# Altium project ESP32_SOAD.PrjPcb
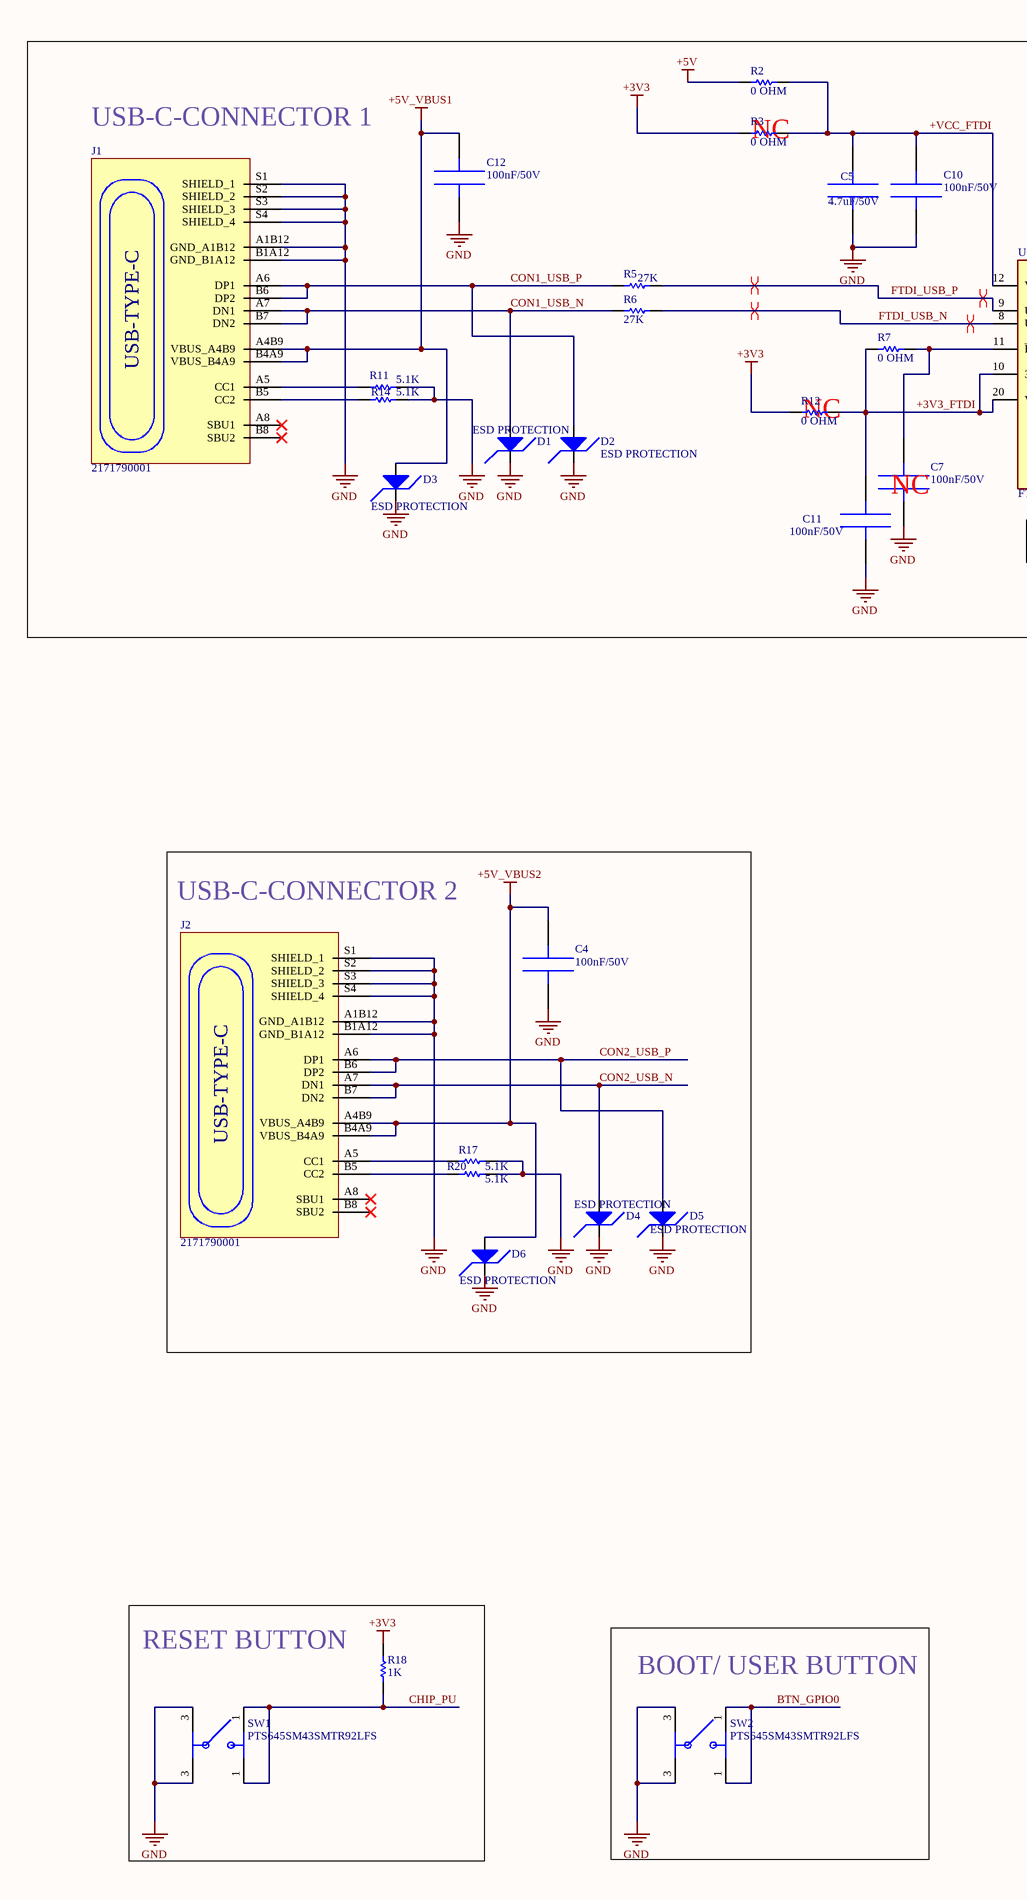
[diagram p0: ESP32-SCH.SchDoc, left]
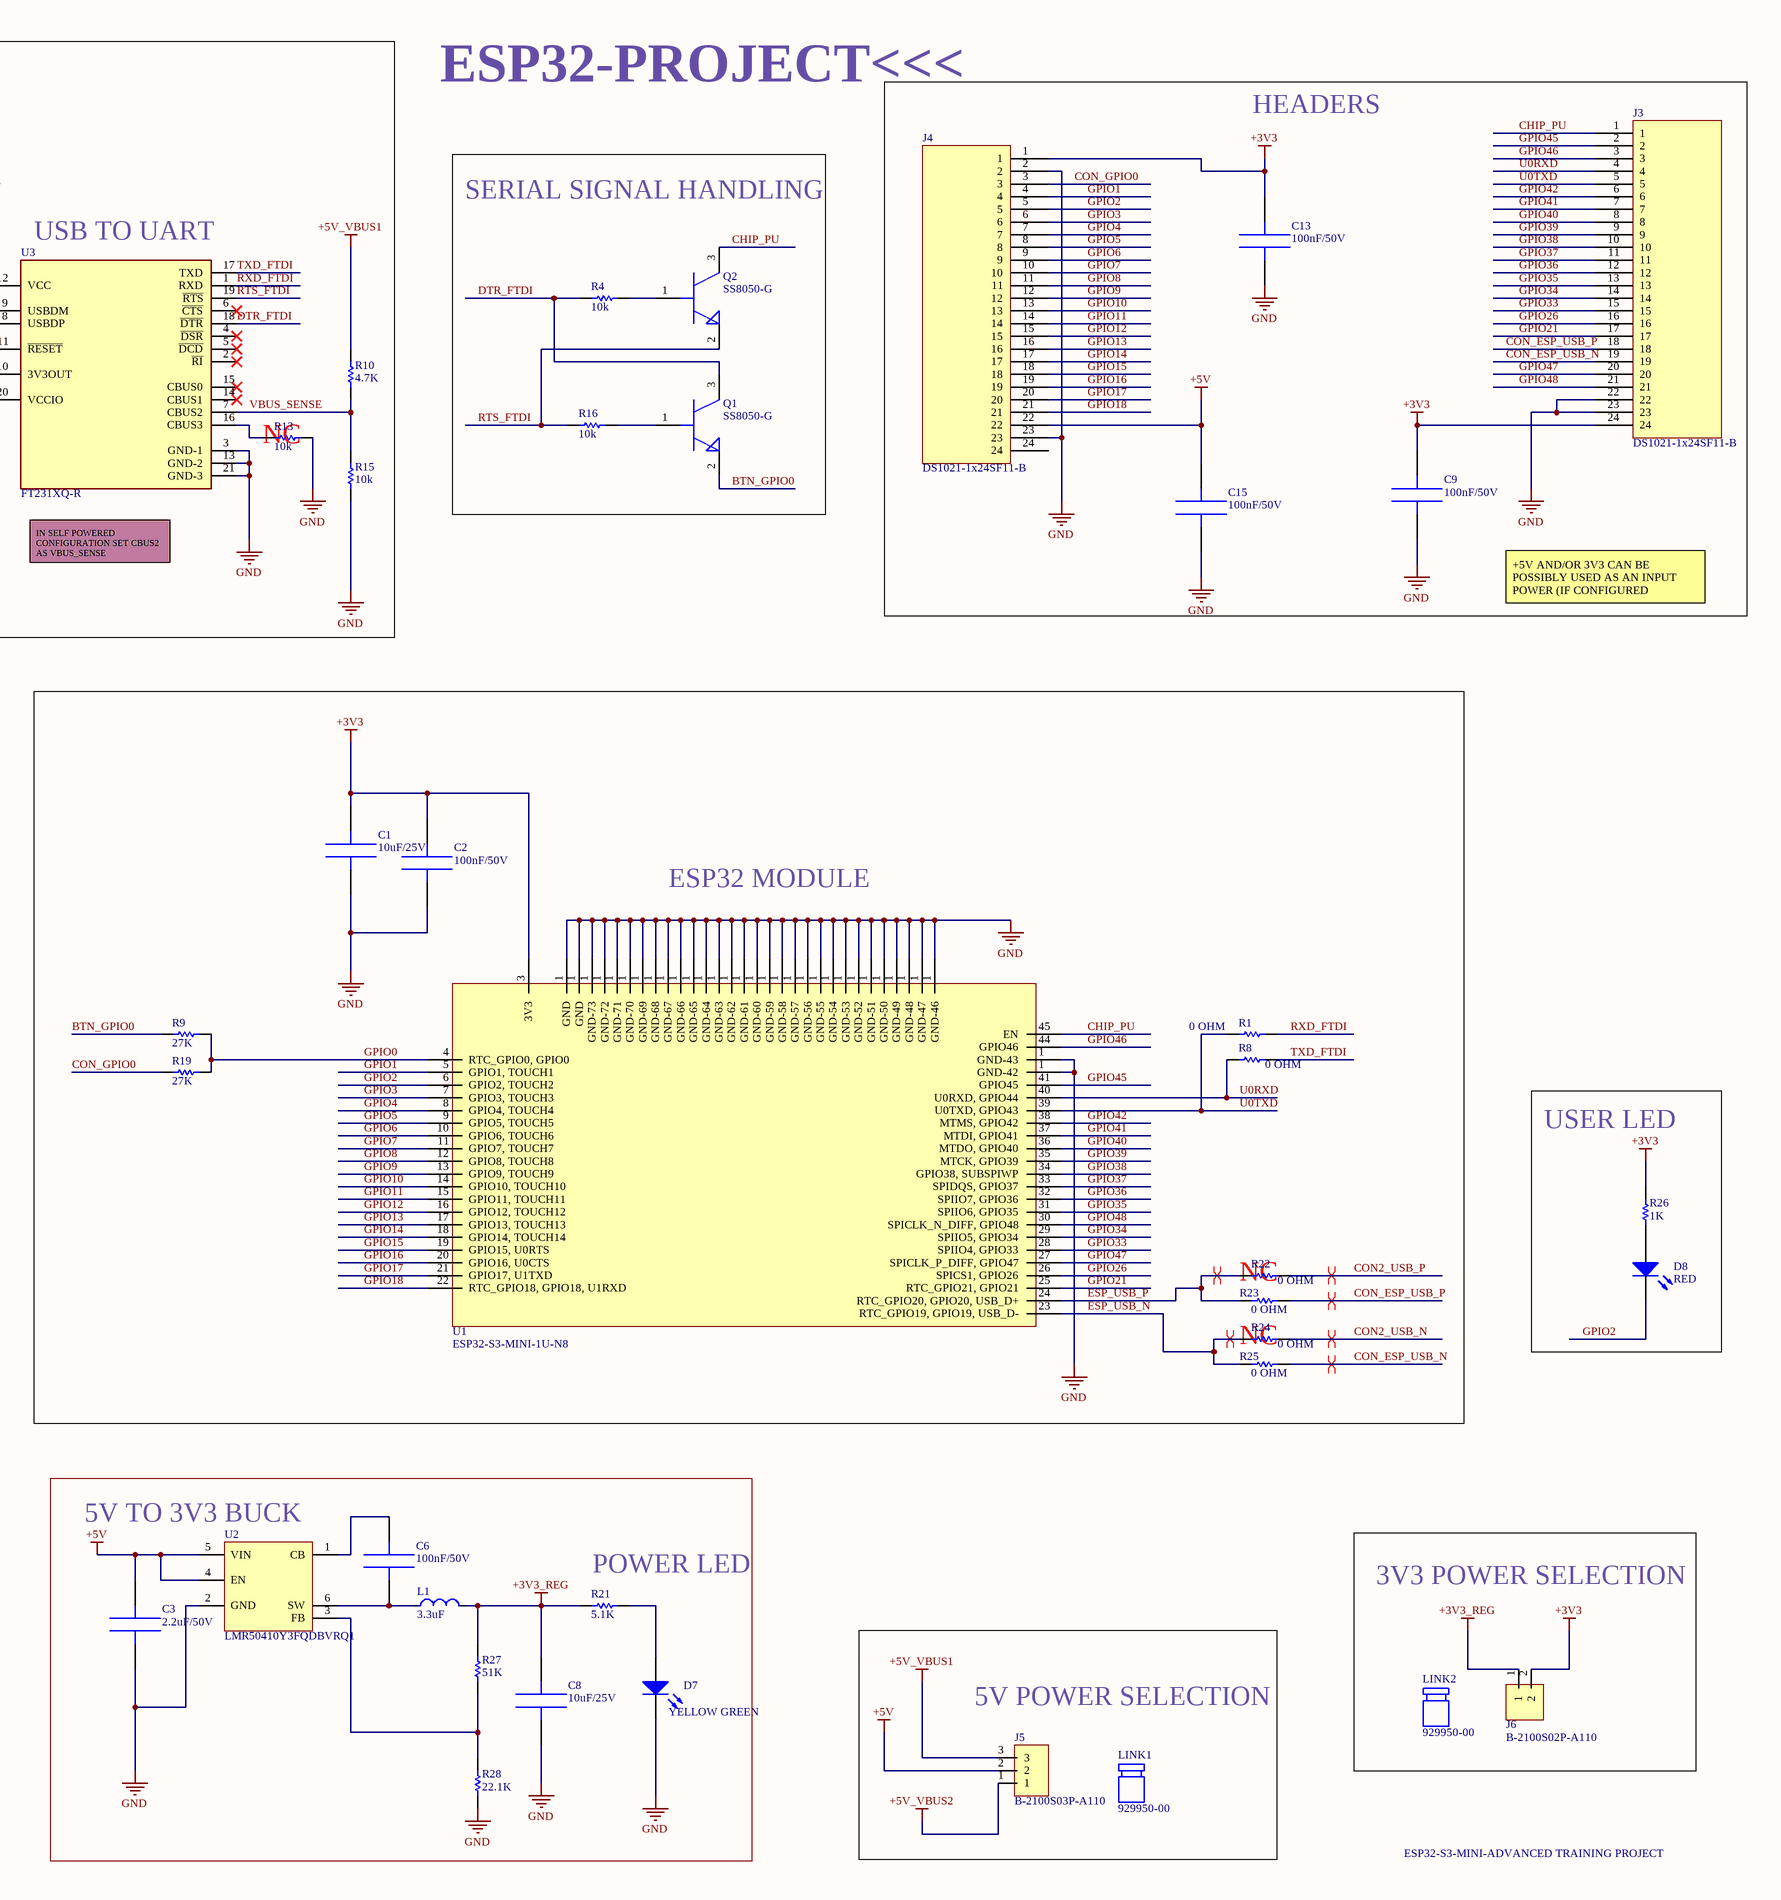
[diagram p1: ESP32-SCH.SchDoc, right]
1 sheet, 66 parts. Net scope: global (net labels, ports and power ports of the same name join across sheets).
Board file: ESP32-PCB.PcbDoc

## Sheet ESP32-SCH.SchDoc
size A2; SheetNumber: 1; SheetTotal: 1

### Parts
C1  10uF/25V  [CL05A106MP8NUB8]
C2  100nF/50V  [CL05A106MP8NUB8]
C3  2.2uF/50V  [CL05A106MP8NUB8]
C4  100nF/50V  [CL05A106MP8NUB8]
C5  4.7uF/50V  [CC0603KRX7R9BB104]
C6  100nF/50V  [CL05A106MP8NUB8]
C7  100nF/50V  [CL05A106MP8NUB8]
C8  10uF/25V  [CL05A106MP8NUB8]
C9  100nF/50V  [CL05A106MP8NUB8]
C10  100nF/50V  [CL05A106MP8NUB8]
C11  100nF/50V  [CL05A106MP8NUB8]
C12  100nF/50V  [CL05A106MP8NUB8]
C13  100nF/50V  [CL05A106MP8NUB8]
C15  100nF/50V  [CL05A106MP8NUB8]
D1  ESD PROTECTION  [ESD5Z3.3T1G]
D2  ESD PROTECTION  [ESD5Z3.3T1G]
D3  ESD PROTECTION  [ESD5Z3.3T1G]
D4  ESD PROTECTION  [ESD5Z3.3T1G]
D5  ESD PROTECTION  [ESD5Z3.3T1G]
D6  ESD PROTECTION  [ESD5Z3.3T1G]
D7  YELLOW GREEN  [VLMG1500-GS08]
D8  RED  [VLMG1500-GS08]
J1  2171790001  [217179-0001]
J2  2171790001  [217179-0001]
J3  DS1021-1x24SF11-B  [DS1021-1x24SF11]
J4  DS1021-1x24SF11-B  [DS1021-1x24SF11]
J5  B-2100S03P-A110  [B-2100S03P-A110]
J6  B-2100S02P-A110  [B-2100S02P-A110]
L1  3.3uF  [MLZ2012N3R3LT000]
LINK1  929950-00  (mechanical)
LINK2  929950-00  (mechanical)
Q1  SS8050-G  [SS8050-G]
Q2  SS8050-G  [SS8050-G]
R1  0 OHM  [RC0402JR]
R2  0 OHM  [RC0402JR]
R3  0 OHM  [RC0402JR]
R4  10k  [RC0402JR]
R5  27K  [RC0402JR]
R6  27K  [RC0402JR]
R7  0 OHM  [RC0402JR]
R8  0 OHM  [RC0402JR]
R9  27K  [RC0402JR]
R10  4.7K  [RC0402JR]
R11  5.1K  [AC0402FR-075K1L]
R12  0 OHM  [RC0402JR]
R13  10k  [RC0402JR]
R14  5.1K  [AC0402FR-075K1L]
R15  10k  [RC0402JR]
R16  10k  [RC0402JR]
R17  5.1K  [AC0402FR-075K1L]
R18  1K  [0603WAF1001T5E]
R19  27K  [RC0402JR]
R20  5.1K  [AC0402FR-075K1L]
R21  5.1K  [AC0402FR-075K1L]
R22  0 OHM  [RC0402JR]
R23  0 OHM  [RC0402JR]
R24  0 OHM  [RC0402JR]
R25  0 OHM  [RC0402JR]
R26  1K  [0603WAF1001T5E]
R27  51K  [RC0402JR]
R28  22.1K  [RC0402JR]
SW1  PTS645SM43SMTR92LFS  [PTS645SM43SMTR92LFS]
SW2  PTS645SM43SMTR92LFS  [PTS645SM43SMTR92LFS]
U1  ESP32-S3-MINI-1U-N8  [ESP32-S3-MINI-1U-N8_1]
U2  LMR50410Y3FQDBVRQ1  [LMR50410Y3FQDBVRQ1]
U3  FT231XQ-R  [FT231XQ-R]

### Blocks framed on the sheet
HEADERS: C9 C13 C15 J3 J4
SERIAL SIGNAL HANDLING: Q1 Q2 R4 R16
USB-C-CONNECTOR 2: C4 D4-D6 J2 R17 R20
USER LED: D8 R26
3V3 POWER SELECTION: J6
RESET BUTTON: R18 SW1
BOOT/ USER BUTTON: SW2
5V POWER SELECTION: J5

### Nets
+3V3: C1.2 C2.2 C9.2 C13.2 J3.24 J4.1 J6.2 R3.1 R12.1 R18.2 R26.2 U1.3(3V3)
+3V3_REG: C8.2 J6.1 L1.2 R21.1 R27.2
+5V: C3.1 C15.2 J4.22 J5.2 R2.1 U2.4(EN) U2.5(VIN)
+5V_VBUS1: C12.2 D3.2 J1.A4B9(VBUS_A4B9) J1.B4A9(VBUS_B4A9) J5.3 R10.2
+5V_VBUS2: C4.2 D6.2 J2.A4B9(VBUS_A4B9) J2.B4A9(VBUS_B4A9) J5.1
GND: C1.1 C2.1 C3.2 C4.1 C5.1 C7.1 C8.1 C9.1 C10.1 C11.1 C12.1 C13.1 C15.1 D1.1 D2.1 D3.1 D4.1 D5.1 D6.1 D7.2 J1.A1B12(GND_A1B12) J1.B1A12(GND_B1A12) J1.S1(SHIELD_1) J1.S2(SHIELD_2) J1.S3(SHIELD_3) J1.S4(SHIELD_4) J2.A1B12(GND_A1B12) J2.B1A12(GND_B1A12) J2.S1(SHIELD_1) J2.S2(SHIELD_2) J2.S3(SHIELD_3) J2.S4(SHIELD_4) J3.22 J3.23 J4.2 J4.23 R11.2 R13.2 R14.2 R15.1 R17.2 R20.2 R28.1 SW1.3 SW2.3 U1.1(GND-46) U2.2(GND) U3.3(GND-1) U3.13(GND-2) U3.21(GND-3)
+3V3_FTDI: C11.2 R7.1 R12.2 U3.10(3V3OUT) U3.20(VCCIO)
+VCC_FTDI: C5.2 C10.2 R2.2 R3.2 U3.12(VCC)
BTN_GPIO0: Q1.2(E) R9.1 SW2.1
CHIP_PU: J3.1 Q2.3(C) R18.1 SW1.1 U1.45(EN)
CON1_USB_N: D1.2 J1.A7(DN1) J1.B7(DN2) R6.1
CON1_USB_P: D2.2 J1.A6(DP1) J1.B6(DP2) R5.1
CON2_USB_N: D4.2 J2.A7(DN1) J2.B7(DN2) R24.2
CON2_USB_P: D5.2 J2.A6(DP1) J2.B6(DP2) R22.2
CON_ESP_USB_N: J3.19 R25.2
CON_ESP_USB_P: J3.18 R23.2
CON_GPIO0: J4.3 R19.1
DTR_FTDI: Q1.3(C) R4.1 U3.18(~{DTR})
ESP_USB_N: R24.1 R25.1 U1.23(RTC_GPIO19,_GPIO19,_USB_D-)
ESP_USB_P: R22.1 R23.1 U1.24(RTC_GPIO20,_GPIO20,_USB_D+)
FTDI_USB_N: R6.2 U3.8(USBDP)
FTDI_USB_P: R5.2 U3.9(USBDM)
GPIO0: R9.2 R19.2 U1.4(RTC_GPIO0,_GPIO0)
GPIO1: J4.4 U1.5(GPIO1,_TOUCH1)
GPIO2: D8.2 J4.5 U1.6(GPIO2,_TOUCH2)
GPIO3: J4.6 U1.7(GPIO3,_TOUCH3)
GPIO4: J4.7 U1.8(GPIO4,_TOUCH4)
GPIO5: J4.8 U1.9(GPIO5,_TOUCH5)
GPIO6: J4.9 U1.10(GPIO6,_TOUCH6)
GPIO7: J4.10 U1.11(GPIO7,_TOUCH7)
GPIO8: J4.11 U1.12(GPIO8,_TOUCH8)
GPIO9: J4.12 U1.13(GPIO9,_TOUCH9)
GPIO10: J4.13 U1.14(GPIO10,_TOUCH10)
GPIO11: J4.14 U1.15(GPIO11,_TOUCH11)
GPIO12: J4.15 U1.16(GPIO12,_TOUCH12)
GPIO13: J4.16 U1.17(GPIO13,_TOUCH13)
GPIO14: J4.17 U1.18(GPIO14,_TOUCH14)
GPIO15: J4.18 U1.19(GPIO15,_U0RTS)
GPIO16: J4.19 U1.20(GPIO16,_U0CTS)
GPIO17: J4.20 U1.21(GPIO17,_U1TXD)
GPIO18: J4.21 U1.22(RTC_GPIO18,_GPIO18,_U1RXD)
GPIO21: J3.17 U1.25(RTC_GPIO21,_GPIO21)
GPIO26: J3.16 U1.26(SPICS1,_GPIO26)
GPIO33: J3.15 U1.28(SPIIO4,_GPIO33)
GPIO34: J3.14 U1.29(SPIIO5,_GPIO34)
GPIO35: J3.13 U1.31(SPIIO6,_GPIO35)
GPIO36: J3.12 U1.32(SPIIO7,_GPIO36)
GPIO37: J3.11 U1.33(SPIDQS,_GPIO37)
GPIO38: J3.10 U1.34(GPIO38,_SUBSPIWP)
GPIO39: J3.9 U1.35(MTCK,_GPIO39)
GPIO40: J3.8 U1.36(MTDO,_GPIO40)
GPIO41: J3.7 U1.37(MTDI,_GPIO41)
GPIO42: J3.6 U1.38(MTMS,_GPIO42)
GPIO45: J3.2 U1.41(GPIO45)
GPIO46: J3.3 U1.44(GPIO46)
GPIO47: J3.20 U1.27(SPICLK_P_DIFF,_GPIO47)
GPIO48: J3.21 U1.30(SPICLK_N_DIFF,_GPIO48)
RTS_FTDI: Q2.2(E) R16.1 U3.19(~{RTS})
RXD_FTDI: R1.2 U3.1(RXD)
TXD_FTDI: R8.2 U3.17(TXD)
U0RXD: J3.4 R8.1 U1.40(U0RXD,_GPIO44)
U0TXD: J3.5 R1.1 U1.39(U0TXD,_GPIO43)
VBUS_SENSE: R10.1 R15.2 U3.7(CBUS2)
NetC6_1: C6.1 L1.1 U2.6(SW)
NetC6_2: C6.2 U2.1(CB)
NetC7_2: C7.2 R7.2 U3.11(~{RESET})
NetD7_1: D7.1 R21.2
NetD8_1: D8.1 R26.1
NetJ1_A5: J1.A5(CC1) R11.1
NetJ1_B5: J1.B5(CC2) R14.1
NetJ2_A5: J2.A5(CC1) R17.1
NetJ2_B5: J2.B5(CC2) R20.1
NetQ1_1: Q1.1(B) R16.2
NetQ2_1: Q2.1(B) R4.2
NetR13_1: R13.1 U3.16(CBUS3)
NetR27_1: R27.1 R28.2 U2.3(FB)

Not connected (* = marked no-connect by the designer): J1 A8(SBU1)* B8(SBU2)*; J2 A8(SBU1)* B8(SBU2)*; J4 24; U3 2(~{RI})* 4(~{DSR})* 5(~{DCD})* 6(~{CTS})* 14(CBUS1)* 15(CBUS0)*

### Layout directives
differential pair; differential pair class DIFF90: CON2_USB_N, CON2_USB_P, CON_ESP_USB_N, CON_ESP_USB_P, ESP_USB_N, ESP_USB_P, FTDI_USB_N, FTDI_USB_P

### Notes on the sheet
- ESP32-PROJECT<<<
- USB-C-CONNECTOR 1
- (near R3) NC
- (near U3) USB TO UART
- (near R12) NC
- (near R13) NC
- (near C7) NC
- (near U3) IN SELF POWERED CONFIGURATION SET CBUS2 AS VBUS_SENSE
- +5V AND/OR 3V3 CAN BE POSSIBLY USED AS AN INPUT POWER (IF CONFIGURED CORRECTLY)
- ESP32 MODULE
- (near R22) NC
- (near R24) NC
- (near U2) 5V TO 3V3 BUCK
- (near R21) POWER LED
- ESP32-S3-MINI-ADVANCED TRAINING PROJECT
- (in symbol 217179-0001) USB-TYPE-C

### Library data of the parts
C1 C8 = CL05A106MP8NUB8: Ceramic Capacitor, Multilayer, Ceramic, 10V, 20% +Tol, 20% -Tol, X5R, 15% TC, 10uF, Surface Mount, 0402; Manufacturer: Samsung; Multilayer: Yes; Supplier: Mouser; Supplier Part Number: 187-CL05A106MP8NUB8; Manufacturer Part Number: CL05A106MP8NUB8; RoHS: Yes; Category: Ceramic Capacitors; Stock: 496808; Pricing: 1=0.32, 10=0.159, 50=0.159, 100=0.102, 1000=0.086, 10000=0.067 (USD); Mounting Technology: Surface Mount; Pins: 2; Dielectric Material: Ceramic; Package Shape: Rectangular; Case/Package: 0402; Terminal Finish: Nickel; Min Operating Temperature: -55°C; Max Operating Temperature: 85°C; JESD-609 Code: e3; Value: 10uF; Capacitor Type: Ceramic; Tolerance  (fill in as +-): 20%; Packaging: Tape and Reel; Tolerance (fill in as +-): 20%; Rated DC Voltage (URdc): 10V; Temperature Characteristics Code: X5R; Termination: Wraparound; Reach SVHC Compliant: Yes; RoHS Compliant: Yes; ComponentLink1URL: https://datasheet.ciiva.com:443/pdfs/VipMasterIC/IC/SEMS/SEMS-S-A0008521219/SEMS-S-A0008521325-1.pdf?src-supplier=IHS+Markit; ComponentLink1Description: https://datasheet.ciiva.com:443/pdfs/VipMasterIC/IC/SEMS/SEMS-S-A0008521219/SEMS-S-A0008521325-1.pdf?src-supplier=IHS+Markit; ComponentLink2URL: http://www.samsungsem.com/kr/support/product-search/mlcc/CL05A106MP8NUB8.jsp?src-supplier=Digikey; ComponentLink2Description: http://www.samsungsem.com/kr/support/product-search/mlcc/CL05A106MP8NUB8.jsp?src-supplier=Digikey; ComponentLink3URL: https://datasheet.octopart.com/CL05A106MP8NUB8-Samsung-Electro-Mechanics-datasheet-136460857.pdf?src-supplier=Future+Electronics; ComponentLink3Description: https://datasheet.octopart.com/CL05A106MP8NUB8-Samsung-Electro-Mechanics-datasheet-136460857.pdf?src-supplier=Future+Electronics; LCSC PART NUMBER: C307415
C2 C4 C6 C7 C9-C13 C15 = CL10A105KP8NNNC: Ceramic Capacitor, Multilayer, Ceramic, 10V, 10% +Tol, 10% -Tol, X5R, 15% TC, 1uF, Surface Mount, 0603; Manufacturer: Samsung; Multilayer: Yes; Supplier: Mouser; Supplier Part Number: 187-CL10A105KP8NNNC; Manufacturer Part Number: CL10A105KP8NNNC; RoHS: Yes; Category: Ceramic Capacitors; Stock: 76214; Pricing: 1=0.1, 10=0.018, 50=0.018, 100=0.011, 1000=0.009, 10000=0.005 (USD); Mounting Technology: Surface Mount; Pins: 2; Dielectric Material: Ceramic; Package Shape: Rectangular; Case/Package: 0603; Terminal Finish: Nickel; Min Operating Temperature: -55°C; Max Operating Temperature: 85°C; JESD-609 Code: e3; Value: 1uF; Capacitor Type: Ceramic; Tolerance  (fill in as +-): 10%; Package Style: SMTMeter; Packaging: Tape and Reel; Tolerance (fill in as +-): 10%; Rated DC Voltage (URdc): 10V; Temperature Characteristics Code: X5R; Termination: Wraparound; Length: 1.6mm; Width: 0.8mm; Height: 0.9mm; Reach SVHC Compliant: Yes; RoHS Compliant: Yes; ComponentLink1URL: https://datasheet.ciiva.com:443/pdfs/VipMasterIC/IC/SEMS/SEMS-S-A0008521003/SEMS-S-A0008520845-1.pdf?src-supplier=IHS+Markit; ComponentLink1Description: https://datasheet.ciiva.com:443/pdfs/VipMasterIC/IC/SEMS/SEMS-S-A0008521003/SEMS-S-A0008520845-1.pdf?src-supplier=IHS+Markit; ComponentLink2URL: https://datasheet.ciiva.com/15195/getdatasheetpartid-358616-15195708.pdf?src-supplier=Verical; ComponentLink2Description: https://datasheet.ciiva.com/15195/getdatasheetpartid-358616-15195708.pdf?src-supplier=Verical; ComponentLink3URL: https://datasheet.ciiva.com/16358/cl05b104kq5nnnc-16358431.pdf?src-supplier=Future+Electronics; ComponentLink3Description: https://datasheet.ciiva.com/16358/cl05b104kq5nnnc-16358431.pdf?src-supplier=Future+Electronics; LCSC PART NUMBER: C14445
C3 = CL10A225KB8NNNC: Ceramic Capacitor, Multilayer, Ceramic, 50V, 10% +Tol, 10% -Tol, X5R, 15% TC, 2.2uF, Surface Mount, 0603; Manufacturer: Samsung; Multilayer: Yes; Supplier: LCSC; Supplier Part Number: C913904; Manufacturer Part Number: CL10A225KB8NNNC; RoHS: Yes; Category: Ceramic Capacitors; Stock: 400299; Pricing: 20=0.0212, 200=0.017, 600=0.0152, 4000=0.0117, 8000=0.0111, 20000=0.0108 (USD); Mounting Technology: Surface Mount; Pins: 2; Dielectric Material: Ceramic; Package Shape: Rectangular; Case/Package: 0603; Min Operating Temperature: -55°C; Max Operating Temperature: 85°C; Value: 2.2uF; Capacitor Type: Ceramic; Tolerance  (fill in as +-): 10%; Packaging: Tape and Reel; Tolerance (fill in as +-): 10%; Rated DC Voltage (URdc): 50V; Temperature Characteristics Code: X5R; Termination: Wraparound; Reach SVHC Compliant: Yes; RoHS Compliant: Yes; ComponentLink1URL: https://datasheet.ciiva.com:443/pdfs/VipMasterIC/IC/SEMS/SEMS-S-A0008526420/SEMS-S-A0008525294-1.pdf?src-supplier=IHS+Markit; ComponentLink1Description: https://datasheet.ciiva.com:443/pdfs/VipMasterIC/IC/SEMS/SEMS-S-A0008526420/SEMS-S-A0008525294-1.pdf?src-supplier=IHS+Markit; LCSC PART NUMBER: C913904
C5 = CC0603KRX7R9BB104: Ceramic Capacitor, Multilayer, Ceramic, 50V, 10% +Tol, 10% -Tol, X7R, 15% TC, 0.1uF, Surface Mount, 0603; Manufacturer: Yageo; Value: 100nF; Multilayer: Yes; Supplier: Future Electronics; Supplier Part Number: 3035896; Manufacturer Part Number: CC0603KRX7R9BB104; RoHS: Yes; Category: Ceramic Capacitors; Stock: 11484000; Pricing: 4000=0.0049, 16000=0.0047, 60000=0.0045, 160000=0.0044, 400000=0.0042 (USD); Mounting Technology: Surface Mount; Pins: 2; Dielectric Material: Ceramic; Package Shape: Rectangular; Case/Package: 0603; Terminal Finish: Nickel; Min Operating Temperature: -55°C; Max Operating Temperature: 125°C; JESD-609 Code: e3; Capacitor Type: Ceramic; Tolerance  (fill in as +-): 10%; Package Style: SMTMeter; Packaging: Tape and Reel; Tolerance (fill in as +-): 10%; Rated DC Voltage (URdc): 50V; Temperature Characteristics Code: X7R; Termination: Wraparound; Length: 1.6mm; Width: 0.8mm; Height: 0.8mm; Reach SVHC Compliant: Yes; RoHS Compliant: Yes; ComponentLink1URL: https://datasheet.ciiva.com:443/pdfs/VipMasterIC/IC/YAGO/YAGO-S-A0003557223/YAGO-S-A0003557223-1.pdf?src-supplier=IHS+Markit; ComponentLink1Description: https://datasheet.ciiva.com:443/pdfs/VipMasterIC/IC/YAGO/YAGO-S-A0003557223/YAGO-S-A0003557223-1.pdf?src-supplier=IHS+Markit; ComponentLink2URL: https://datasheet.ciiva.com/11786/0900766b80d84f1d-11786061.pdf?src-supplier=Rs; ComponentLink2Description: https://datasheet.ciiva.com/11786/0900766b80d84f1d-11786061.pdf?src-supplier=Rs; ComponentLink3URL: https://datasheet.ciiva.com/8033/70765-8033819.pdf?src-supplier=Element14; ComponentLink3Description: https://datasheet.ciiva.com/8033/70765-8033819.pdf?src-supplier=Element14; ComponentLink4URL: https://datasheet.ciiva.com/8033/70765-8033821.pdf?src-supplier=Element14; ComponentLink4Description: https://datasheet.ciiva.com/8033/70765-8033821.pdf?src-supplier=Element14; ComponentLink5URL: https://datasheet.ciiva.com/7978/1489800-7978166.pdf?src-supplier=Element14; ComponentLink5Description: https://datasheet.ciiva.com/7978/1489800-7978166.pdf?src-supplier=Element14; ComponentLink6URL: https://datasheet.ciiva.com/31394/1489800-31394927.pdf?src-supplier=Farnell; ComponentLink6Description: https://datasheet.ciiva.com/31394/1489800-31394927.pdf?src-supplier=Farnell; ComponentLink7URL: https://datasheet.ciiva.com/22749/1489800-22749214.pdf?src-supplier=Element14; ComponentLink7Description: https://datasheet.ciiva.com/22749/1489800-22749214.pdf?src-supplier=Element14; ComponentLink8URL: https://datasheet.ciiva.com/144/mlccorderingcode-144177.pdf?src-supplier=Digikey; ComponentLink8Description: https://datasheet.ciiva.com/144/mlccorderingcode-144177.pdf?src-supplier=Digikey; ComponentLink9URL: https://datasheet.ciiva.com/144/mlccorderingcode-144176.pdf?src-supplier=Digikey; ComponentLink9Description: https://datasheet.ciiva.com/144/mlccorderingcode-144176.pdf?src-supplier=Digikey; ComponentLink10URL: https://datasheet.ciiva.com/144/mlccorderingcode-144178.pdf?src-supplier=Digikey; ComponentLink10Description: https://datasheet.ciiva.com/144/mlccorderingcode-144178.pdf?src-supplier=Digikey; LCSC PART NUMBER: C14663
D1-D6 = ESD5Z3.3T1G: Trans Voltage Suppressor Diode, 158W, 3.3V V(RWM), Unidirectional, 1 Element, Silicon; Manufacturer: ON Semiconductor; Package Body Material: Plastic; Min Breakdown Voltage: 5V; Number of Elements: 1; Clamping Voltage-Max: 8.4V; Max Power Dissipation: 200mW; Additional Feature: UL RECOGNIZED; Reference Standard: IEC-61000-4-2; Qualification Status: Not Qualified; Supplier: Future Electronics; Supplier Part Number: 8196941; Manufacturer Part Number: ESD5Z3.3T1G; RoHS: Yes; Category: ESD and Circuit Protection ICs; Stock: 1197000; Pricing: 3000=0.0569, 9000=0.0547, 15000=0.0538, 45000=0.0518, 75000=0.05 (USD); Pins: 2; Diode Element Material: SILICON; Package Shape: Rectangular; Terminal Finish: Tin; Min Operating Temperature: -55°C; Max Operating Temperature: 150°C; JESD-609 Code: e3; Polarity: Unidirectional; Diode Type: TRANS VOLTAGE SUPPRESSOR; JESD-30 Code: R-PDSO-F2; Package Style: SMALL OUTLINEMeter; Rep Pk Reverse Voltage-Max: 3.3V; Surface Mount: Yes; Technology: AVALANCHE; Terminal Form: Flat; Terminal Position: DUAL; Moisture Sensitivity Level: 1; Non-rep Peak Rev Power Dis-Max: 158W; Reach SVHC Compliant: Yes; RoHS Compliant: Yes; ComponentLink1URL: https://datasheet.ciiva.com:443/pdfs/VipMasterIC/IC/ONSM/ONSM-S-A0006325923/ONSM-S-A0006325923-1.pdf?src-supplier=IHS+Markit; ComponentLink1Description: https://datasheet.ciiva.com:443/pdfs/VipMasterIC/IC/ONSM/ONSM-S-A0006325923/ONSM-S-A0006325923-1.pdf?src-supplier=IHS+Markit; LCSC PART NUMBER: C61148
D7 = VLMG1500-GS08: Single Color LED, Yellow Green, 0.5mm; Manufacturer: Vishay; Color: Green,Yellow; Shape: Rectangular; Forward Current: 30mA; Forward Voltage: 2.4V; Luminous Intensity-Nom: 90mcd; Channels: 1; Reverse Voltage-Max: 5V; Viewing Angle: 130°; Overall Height: 0.35mm; Supplier: Future Electronics; Supplier Part Number: 2044562; Manufacturer Part Number: VLMG1500-GS08; RoHS: Yes; Category: LEDs; Stock: 30000; Pricing: 3000=0.0548, 6000=0.0534, 12000=0.0521, 15000=0.0516, 45000=0.0491 (USD); Mounting Technology: Surface Mount; Pins: 2; Color@wavelength: Green; Min Operating Temperature: -30°C; Max Operating Temperature: 85°C; Optoelectronic Device Type: SINGLE COLOR LED; Packaging: Tape and Reel; Size: 0.5mm; Terminal Pitch: 0.95mm; Reach SVHC Compliant: Yes; RoHS Compliant: Yes; ComponentLink1URL: https://datasheet.ciiva.com:443/pdfs/VipMasterIC/IC/VISH/VISH-S-A0003457490/VISH-S-A0003457490-1.pdf?src-supplier=IHS+Markit; ComponentLink1Description: https://datasheet.ciiva.com:443/pdfs/VipMasterIC/IC/VISH/VISH-S-A0003457490/VISH-S-A0003457490-1.pdf?src-supplier=IHS+Markit; ComponentLink2URL: https://datasheet.ciiva.com/12071/vlmo1500-244705-12071911.pdf?src-supplier=Mouser; ComponentLink2Description: https://datasheet.ciiva.com/12071/vlmo1500-244705-12071911.pdf?src-supplier=Mouser; ComponentLink3URL: https://datasheet.ciiva.com/30005/vlmo1500-30005134.pdf?src-supplier=Avnet; ComponentLink3Description: https://datasheet.ciiva.com/30005/vlmo1500-30005134.pdf?src-supplier=Avnet; LCSC PART NUMBER: C511404
D8 = VLMS1500-GS08: Single Color LED, Super Red, 0.5mm; Manufacturer: Vishay; Shape: Rectangular; Forward Current: 30mA; Forward Voltage: 2.4V; Luminous Intensity-Nom: 54mcd; Channels: 1; Reverse Voltage-Max: 5V; Viewing Angle: 130°; Overall Height: 0.35mm; Supplier: Mouser; Supplier Part Number: 78-VLMS1500-GS08; Manufacturer Part Number: VLMS1500-GS08; RoHS: Yes; Category: LEDs; Stock: 45181; Pricing: 1=0.34, 10=0.263, 50=0.263, 100=0.1, 1000=0.089, 10000=0.061 (USD); Mounting Technology: Surface Mount; Pins: 2; Color: Red; Color@wavelength: Red; Min Operating Temperature: -30°C; Max Operating Temperature: 85°C; Optoelectronic Device Type: SINGLE COLOR LED; Packaging: Tape and Reel; Size: 0.5mm; Terminal Pitch: 0.95mm; Reach SVHC Compliant: Yes; RoHS Compliant: Yes; ComponentLink1URL: https://datasheet.ciiva.com:443/pdfs/VipMasterIC/IC/VISH/VISH-S-A0003457490/VISH-S-A0003457490-1.pdf?src-supplier=IHS+Markit; ComponentLink1Description: https://datasheet.ciiva.com:443/pdfs/VipMasterIC/IC/VISH/VISH-S-A0003457490/VISH-S-A0003457490-1.pdf?src-supplier=IHS+Markit; ComponentLink2URL: http://www.farnell.com/datasheets/1809983.pdf?src-supplier=Farnell; ComponentLink2Description: http://www.farnell.com/datasheets/1809983.pdf?src-supplier=Farnell; ComponentLink3URL: http://www.mouser.com/ds/2/427/vlmo1500-244705.pdf?src-supplier=Mouser; ComponentLink3Description: http://www.mouser.com/ds/2/427/vlmo1500-244705.pdf?src-supplier=Mouser; ComponentLink4URL: http://www.alliedelec.com/m/d/cfc385e1097fc985ee9a50a3551ac188.pdf?src-supplier=Allied+Electronics; ComponentLink4Description: http://www.alliedelec.com/m/d/cfc385e1097fc985ee9a50a3551ac188.pdf?src-supplier=Allied+Electronics; ComponentLink5URL: https://datasheet.octopart.com/VLMS1500-GS08-Vishay-datasheet-62332426.pdf?src-supplier=Newark; ComponentLink5Description: https://datasheet.octopart.com/VLMS1500-GS08-Vishay-datasheet-62332426.pdf?src-supplier=Newark; ComponentLink6URL: https://datasheet.octopart.com/VLMS1500-GS08-Vishay-datasheet-33014519.pdf?src-supplier=Element14; ComponentLink6Description: https://datasheet.octopart.com/VLMS1500-GS08-Vishay-datasheet-33014519.pdf?src-supplier=Element14; ComponentLink7URL: http://datasheet.octopart.com/VLMS1500-GS08-Vishay-datasheet-21227148.pdf?src-supplier=Avnet; ComponentLink7Description: http://datasheet.octopart.com/VLMS1500-GS08-Vishay-datasheet-21227148.pdf?src-supplier=Avnet; ComponentLink8URL: http://www.farnell.com/datasheets/1809983.pdf?src-supplier=Newark; ComponentLink8Description: http://www.farnell.com/datasheets/1809983.pdf?src-supplier=Newark; ComponentLink9URL: http://www.farnell.com/datasheets/2050839.pdf?src-supplier=Newark; ComponentLink9Description: http://www.farnell.com/datasheets/2050839.pdf?src-supplier=Newark; ComponentLink10URL: https://datasheet.octopart.com/VLMS1500-GS08-Vishay-datasheet-21227148.pdf?src-supplier=Future+Electronics; ComponentLink10Description: https://datasheet.octopart.com/VLMS1500-GS08-Vishay-datasheet-21227148.pdf?src-supplier=Future+Electronics; ComponentLink11URL: http://datasheet.octopart.com/VLMS1500-GS08-Vishay-datasheet-21227148.pdf?src-supplier=Quest; ComponentLink11Description: http://datasheet.octopart.com/VLMS1500-GS08-Vishay-datasheet-21227148.pdf?src-supplier=Quest; ComponentLink12URL: http://datasheet.octopart.com/VLMS1500-GS08-Vishay-datasheet-21227148.pdf?src-supplier=NAC+Semi; ComponentLink12Description: http://datasheet.octopart.com/VLMS1500-GS08-Vishay-datasheet-21227148.pdf?src-supplier=NAC+Semi; ComponentLink13URL: http://datasheet.octopart.com/VLMS1500-GS08-Vishay-datasheet-21227148.pdf?src-supplier=LCSC; ComponentLink13Description: http://datasheet.octopart.com/VLMS1500-GS08-Vishay-datasheet-21227148.pdf?src-supplier=LCSC; LCSC PART NUMBER: C511370
J1 J2 = 217179-0001: USB Type C - Connector, Top-mount SMT, 16pos | Molex Incorporated 217179-0001; Supplier: Farnell; Supplier Part Number: 3702965; Manufacturer: Molex; Manufacturer Part Number: 217179-0001; RoHS: No; Category: USB Connectors; Stock: 10084; Pricing: 1=0.817, 10=0.645, 50=0.57, 100=0.494, 500=0.484, 1000=0.474 (GBP); LCSC PART NUMBER: C3197684
J3 J4 = DS1021-1x24SF11-B: Manufacturer: Ningbo Connfly Electric; Supplier: LCSC; Supplier Part Number: C7430380; Manufacturer Part Number: DS1021-1x24SF11-B; RoHS: No; Stock: 439; Pricing: 5=0.1027, 50=0.0832, 200=0.0735, 400=0.0662, 2400=0.0603, 5000=0.0574 (USD); LCSC PART NUMBER: C7430380
J5 = B-2100S03P-A110: Manufacturer: CKMTW; Supplier: LCSC; Supplier Part Number: C124376; Manufacturer Part Number: B-2100S03P-A110; RoHS: No; Category: Uncategorized; Stock: 20930; Pricing: 20=0.0269, 200=0.0224, 600=0.0198, 5000=0.0157, 10000=0.0144, 20000=0.0137 (USD); LCSC PART NUMBER: C124376
J6 = B-2100S02P-A110: Manufacturer: CKMTW; Supplier: LCSC; Supplier Part Number: C124375; Manufacturer Part Number: B-2100S02P-A110; RoHS: No; Category: Uncategorized; Stock: 171541; Pricing: 20=0.0234, 200=0.0192, 600=0.0169, 5000=0.0141, 10000=0.0128, 20000=0.0122 (USD); LCSC PART NUMBER: C124375
L1 = MLZ2012N3R3LT000: General Purpose Inductor, 3.3uH, 20%, 1 Element, Ferrite-Core, SMD, 0805; Manufacturer: TDK; Manufacturer Series: MLZ; Case/Size Code: 0805; DC Resistance (DCR): 150mR; Max Current Rating: 130mA; Self Resonant Frequency: 90MHz; Package Height: 0.85mm; Package Length: 2mm; Package Width: 1.25mm; Supplier: Digikey; Supplier Part Number: 445-6759-2-ND; Manufacturer Part Number: MLZ2012N3R3LT000; RoHS: Yes; Category: Fixed Inductors; Stock: 44000; Pricing: 4000=0.04378, 8000=0.0412, 12000=0.03991, 28000=0.03863, 100000=0.03734 (USD); Core Material: Ferrite; Min Operating Temperature: -55°C; Max Operating Temperature: 125°C; Tolerance: 20%; Construction: Multilayer Chip; Inductance-Nom (L): 3.3uH; Inductor Type: GENERAL PURPOSE INDUCTOR; Package Style: SMTMeter; Packaging: Tape and Reel; Series: MLZ2012; Reach SVHC Compliant: Yes; RoHS Compliant: Yes; ComponentLink1URL: https://datasheet.ciiva.com:443/pdfs/VipMasterIC/IC/TDKC/TDKC-S-A0006811741/TDKC-S-A0006811741-1.pdf?src-supplier=IHS+Markit; ComponentLink1Description: https://datasheet.ciiva.com:443/pdfs/VipMasterIC/IC/TDKC/TDKC-S-A0006811741/TDKC-S-A0006811741-1.pdf?src-supplier=IHS+Markit; ComponentLink2URL: https://datasheet.ciiva.com/29690/inductor-commercial-decoupling-mlz-en-29690333.pdf?src-supplier=Digikey; ComponentLink2Description: https://datasheet.ciiva.com/29690/inductor-commercial-decoupling-mlz-en-29690333.pdf?src-supplier=Digikey; ComponentLink3URL: https://datasheet.ciiva.com/29690/inductor-commercial-decoupling-mlz-en-29690334.pdf?src-supplier=Digikey; ComponentLink3Description: https://datasheet.ciiva.com/29690/inductor-commercial-decoupling-mlz-en-29690334.pdf?src-supplier=Digikey; ComponentLink4URL: https://datasheet.ciiva.com/29690/inductor-commercial-decoupling-mlz-en-29690335.pdf?src-supplier=Digikey; ComponentLink4Description: https://datasheet.ciiva.com/29690/inductor-commercial-decoupling-mlz-en-29690335.pdf?src-supplier=Digikey; LCSC PART NUMBER: C2041461
LINK1 LINK2 = 929950-00: INTERCONNECTION DEVICE; Manufacturer: 3M; Connector Type: TWO PART BOARD CONNECTOR; Option: General Purpose; Body/Shell Style: PLUG; Contact Pattern: RECTANGULAR; Contact Style: SQ PIN-SKT; Dielectric Withstanding Voltage (AC): 2.1kV; Filter Feature: No; Insulation Resistance: 1GR; Number Of Connectors: 1; Rated Current (Signal): 1A; Number of Contacts: 2; Body Breadth: 0.095inch; Body Depth: 0.298inch; Body Length: 0.195inch; Mating Contact Pitch: 0.1inch; Reference Standard: UL; Reliability: COMMERCIAL; Supplier: Avnet; Supplier Part Number: 46F4438; Manufacturer Part Number: 929950-00; RoHS: Yes; Category: Headers and Wire Housings; Stock: 2041; Pricing: 1=9.62, 10=8.98, 25=8.33, 50=7.97, 100=7.6 (USD); Contact Material: Copper Alloy; Contact Finish - Mating: NOT SPECIFIED; Insulation Color: Black; Min Operating Temperature: -55°C; Max Operating Temperature: 100°C; Additional Feature: 3M; Contact Gender: Female; Mixed Contacts: No; Mounting Style: STRAIGHT; Number of Rows Loaded: 1; Flammability Rating: UL94 V-0; Reach SVHC Compliant: Yes; RoHS Compliant: Yes; DIN Conformance: No; IEC Conformance: No; MIL Conformance: No; ComponentLink1URL: https://datasheet.ciiva.com:443/pdfs/VipMasterIC/IC/IIIM/IIIM-S-A0001321333/IIIM-S-A0001321333-1.pdf?src-supplier=IHS+Markit; ComponentLink1Description: https://datasheet.ciiva.com:443/pdfs/VipMasterIC/IC/IIIM/IIIM-S-A0001321333/IIIM-S-A0001321333-1.pdf?src-supplier=IHS+Markit; ComponentLink2URL: https://datasheet.ciiva.com/767/ts0200-767888.pdf?src-supplier=Digikey; ComponentLink2Description: https://datasheet.ciiva.com/767/ts0200-767888.pdf?src-supplier=Digikey; ComponentLink3URL: https://datasheet.ciiva.com/19459/1578293-19459904.pdf?src-supplier=Jameco; ComponentLink3Description: https://datasheet.ciiva.com/19459/1578293-19459904.pdf?src-supplier=Jameco; ComponentLink4URL: https://datasheet.ciiva.com/18408/70114996-18408812.pdf?src-supplier=Allied+Electronics; ComponentLink4Description: https://datasheet.ciiva.com/18408/70114996-18408812.pdf?src-supplier=Allied+Electronics; ComponentLink5URL: https://datasheet.ciiva.com/1412/ts0254-1412841.pdf?src-supplier=Element14; ComponentLink5Description: https://datasheet.ciiva.com/1412/ts0254-1412841.pdf?src-supplier=Element14; LCSC PART NUMBER: C6725179
Q1 Q2 = SS8050-G: Small Signal Bipolar Transistor, 1.5A I(C), 25V V(BR)CEO, 1-Element, NPN, Silicon; Manufacturer: Comchip; Supplier: Mouser; Supplier Part Number: 750-SS8050-G; Manufacturer Part Number: SS8050-G; RoHS: Yes; Category: Transistors; Stock: 4983; Pricing: 1=0.29, 10=0.2, 50=0.2, 100=0.082, 1000=0.057, 10000=0.037 (USD); Reach SVHC Compliant: Yes; RoHS Compliant: Yes; ComponentLink1URL: https://datasheet.ciiva.com:443/pdfs/VipMasterIC/IC/COMC/COMC-S-A0004994192/COMC-S-A0004994192-1.pdf?src-supplier=IHS+Markit; ComponentLink1Description: https://datasheet.ciiva.com:443/pdfs/VipMasterIC/IC/COMC/COMC-S-A0004994192/COMC-S-A0004994192-1.pdf?src-supplier=IHS+Markit; ComponentLink2URL: http://www.comchiptech.com/admin/files/product/SS8050-G RevA181526.pdf?src-supplier=Digikey; ComponentLink2Description: http://www.comchiptech.com/admin/files/product/SS8050-G RevA181526.pdf?src-supplier=Digikey; LCSC PART NUMBER: C164885
R1-R3 R7 R8 R12 R22-R25 = RC0402JR-070RL: Metal Glaze/thick Film, 0.0625W, 0ohm, Surface Mount, 0402; Manufacturer: Yageo; Power: 62.5mW; Rated Temperature: 70°C; Value: 0R; Package Height: 0.35mm; Package Length: 1mm; Package Width: 0.5mm; Supplier: Future Electronics; Supplier Part Number: 3375797; Manufacturer Part Number: RC0402JR-070RL; RoHS: Yes; Category: Chip SMD Resistors; Stock: 38530000; Pricing: 10000=0.0011, 50000=0.0011, 250000=0.001, 500000=0.001, 1500000=0.0009 (USD); Mounting Technology: Surface Mount; Pins: 2; Package Shape: Rectangular; Case/Package: 0402; Terminal Finish: Nickel; Min Operating Temperature: -55°C; Max Operating Temperature: 155°C; JESD-609 Code: e3; Resistor Type: FIXED RESISTOR; Packaging: Tape and Reel; Technology: METAL GLAZE/THICK FILM; Termination: Wraparound; Construction: Chip; Package Style: SMTMeter; Reach SVHC Compliant: Yes; RoHS Compliant: Yes; ComponentLink1URL: https://datasheet.ciiva.com:443/pdfs/VipMasterIC/IC/YAGO/YAGO-S-A0008145938/YAGO-S-A0008145938-1.pdf?src-supplier=IHS+Markit; ComponentLink1Description: https://datasheet.ciiva.com:443/pdfs/VipMasterIC/IC/YAGO/YAGO-S-A0008145938/YAGO-S-A0008145938-1.pdf?src-supplier=IHS+Markit; LCSC PART NUMBER: C60485
R4 R13 R15 R16 = RMCF0402FT10K0: Fixed Resistor, Metal Glaze/thick Film, 0.063W, 10000ohm, 50V, 1% +/-Tol, 100ppm/Cel, Surface Mount, 0402; Manufacturer: Stackpole Electronics; Power: 63mW; Rated Temperature: 70°C; Value: 10kR; Temperature Coefficient: 100ppm/°C; Package Height: 0.3mm; Package Length: 1mm; Package Width: 0.5mm; Reference Standard: AEC-Q200; Supplier: Mouser; Supplier Part Number: 708-RMCF0402FT10K0; Manufacturer Part Number: RMCF0402FT10K0; RoHS: Yes; Category: Chip SMD Resistors; Stock: 4866800; Pricing: 1=0.1, 10=0.012, 50=0.012, 100=0.006, 1000=0.005, 10000=0.002 (USD); Mounting Technology: Surface Mount; Pins: 2; Package Shape: Rectangular; Case/Package: 0402; Terminal Finish: Nickel; Min Operating Temperature: -55°C; Max Operating Temperature: 155°C; Tolerance: 1%; JESD-609 Code: e3; Resistor Type: FIXED RESISTOR; Construction: Rectangular; Package Style: SMTMeter; Packaging: Tape and Reel; Technology: METAL GLAZE/THICK FILM; Termination: Wraparound; Working Voltage: 50V; Reach SVHC Compliant: Yes; RoHS Compliant: Yes; ComponentLink1URL: https://datasheet.ciiva.com:443/pdfs/VipMasterIC/IC/SEIE/SEIE-S-A0009541969/SEIE-S-A0009541969-1.pdf?src-supplier=IHS+Markit; ComponentLink1Description: https://datasheet.ciiva.com:443/pdfs/VipMasterIC/IC/SEIE/SEIE-S-A0009541969/SEIE-S-A0009541969-1.pdf?src-supplier=IHS+Markit; ComponentLink2URL: https://datasheet.ciiva.com/24341/sei-rmcp-24341800.pdf?src-supplier=Onlinecomponents.com; ComponentLink2Description: https://datasheet.ciiva.com/24341/sei-rmcp-24341800.pdf?src-supplier=Onlinecomponents.com; LCSC PART NUMBER: C6111655
R5 R6 R9 R19 = RC0402JR-0727KL: Fixed Resistor, Metal Glaze/thick Film, 0.0625W, 27000ohm, 50V, 5% +/-Tol, 100ppm/Cel, Surface Mount, 0402; Manufacturer: Yageo; Additional Feature: LASER TRIMMABLE; Power: 62.5mW; Rated Temperature: 70°C; Value: 27kR; Temperature Coefficient: 100ppm/°C; Package Height: 0.35mm; Package Length: 1mm; Package Width: 0.5mm; Supplier: Future Electronics; Supplier Part Number: 7019441; Manufacturer Part Number: RC0402JR-0727KL; RoHS: Yes; Category: Chip SMD Resistors; Stock: 360000; Pricing: 10000=0.0011, 100000=0.001, 300000=0.001, 750000=0.001, 2000000=0.0009 (USD); Mounting Technology: Surface Mount; Pins: 2; Package Shape: Rectangular; Case/Package: 0402; Terminal Finish: Nickel; Min Operating Temperature: -55°C; Max Operating Temperature: 155°C; Tolerance: 5%; JESD-609 Code: e3; Resistor Type: FIXED RESISTOR; Construction: Chip; Package Style: SMTMeter; Packaging: Tape and Reel; Technology: METAL GLAZE/THICK FILM; Termination: Wraparound; Working Voltage: 50V; Reach SVHC Compliant: Yes; RoHS Compliant: Yes; ComponentLink1URL: https://datasheet.ciiva.com:443/pdfs/VipMasterIC/IC/YAGO/YAGO-S-A0008145938/YAGO-S-A0008145938-1.pdf?src-supplier=IHS+Markit; ComponentLink1Description: https://datasheet.ciiva.com:443/pdfs/VipMasterIC/IC/YAGO/YAGO-S-A0008145938/YAGO-S-A0008145938-1.pdf?src-supplier=IHS+Markit; ComponentLink2URL: https://datasheet.ciiva.com/2452/pyu-r-int-thick-7-2452717.pdf?src-supplier=Digikey; ComponentLink2Description: https://datasheet.ciiva.com/2452/pyu-r-int-thick-7-2452717.pdf?src-supplier=Digikey; ComponentLink3URL: https://datasheet.ciiva.com/2452/pyu-r-int-thick-7-2452718.pdf?src-supplier=Digikey; ComponentLink3Description: https://datasheet.ciiva.com/2452/pyu-r-int-thick-7-2452718.pdf?src-supplier=Digikey; ComponentLink4URL: https://datasheet.ciiva.com/2452/pyu-r-int-thick-7-2452716.pdf?src-supplier=Digikey; ComponentLink4Description: https://datasheet.ciiva.com/2452/pyu-r-int-thick-7-2452716.pdf?src-supplier=Digikey; ComponentLink5URL: https://datasheet.ciiva.com/7850/1018594-7850186.pdf?src-supplier=Element14; ComponentLink5Description: https://datasheet.ciiva.com/7850/1018594-7850186.pdf?src-supplier=Element14; ComponentLink6URL: https://datasheet.ciiva.com/7850/1018594-7850187.pdf?src-supplier=Element14; ComponentLink6Description: https://datasheet.ciiva.com/7850/1018594-7850187.pdf?src-supplier=Element14; ComponentLink7URL: https://datasheet.ciiva.com/16741/pyu-rc0402-51-rohs-l-6-r-16741390.pdf?src-supplier=Future+Electronics; ComponentLink7Description: https://datasheet.ciiva.com/16741/pyu-rc0402-51-rohs-l-6-r-16741390.pdf?src-supplier=Future+Electronics; ComponentLink8URL: https://datasheet.ciiva.com/15189/getdatasheetpartid-329469-15189557.pdf?src-supplier=Verical; ComponentLink8Description: https://datasheet.ciiva.com/15189/getdatasheetpartid-329469-15189557.pdf?src-supplier=Verical; LCSC PART NUMBER: C137891
R10 = RC0402JR-074K7L: Fixed Resistor, Metal Glaze/thick Film, 0.0625W, 4700ohm, 50V, 5% +/-Tol, 100ppm/Cel, Surface Mount, 0402; Manufacturer: Yageo; Additional Feature: LASER TRIMMABLE; Power: 62.5mW; Rated Temperature: 70°C; Value: 4.7kR; Temperature Coefficient: 100ppm/°C; Package Height: 0.35mm; Package Length: 1mm; Package Width: 0.5mm; Supplier: Future Electronics; Supplier Part Number: 4909339; Manufacturer Part Number: RC0402JR-074K7L; RoHS: Yes; Category: Chip SMD Resistors; Stock: 17840000; Pricing: 10000=0.0008, 100000=0.0007, 300000=0.0007, 750000=0.0007, 2000000=0.0006 (USD); Mounting Technology: Surface Mount; Pins: 2; Package Shape: Rectangular; Case/Package: 0402; Terminal Finish: Nickel; Min Operating Temperature: -55°C; Max Operating Temperature: 155°C; Tolerance: 5%; JESD-609 Code: e3; Resistor Type: FIXED RESISTOR; Construction: Chip; Package Style: SMTMeter; Packaging: Tape and Reel; Technology: METAL GLAZE/THICK FILM; Termination: Wraparound; Working Voltage: 50V; Reach SVHC Compliant: Yes; RoHS Compliant: Yes; ComponentLink1URL: https://datasheet.ciiva.com:443/pdfs/VipMasterIC/IC/YAGO/YAGO-S-A0008145938/YAGO-S-A0008145938-1.pdf?src-supplier=IHS+Markit; ComponentLink1Description: https://datasheet.ciiva.com:443/pdfs/VipMasterIC/IC/YAGO/YAGO-S-A0008145938/YAGO-S-A0008145938-1.pdf?src-supplier=IHS+Markit; ComponentLink2URL: https://datasheet.ciiva.com/46412/1018594-46412841.pdf?src-supplier=Element14; ComponentLink2Description: https://datasheet.ciiva.com/46412/1018594-46412841.pdf?src-supplier=Element14; ComponentLink3URL: https://datasheet.ciiva.com/2452/pyu-r-int-thick-7-2452612.pdf?src-supplier=Digikey; ComponentLink3Description: https://datasheet.ciiva.com/2452/pyu-r-int-thick-7-2452612.pdf?src-supplier=Digikey; ComponentLink4URL: https://datasheet.ciiva.com/2452/pyu-r-int-thick-7-2452613.pdf?src-supplier=Digikey; ComponentLink4Description: https://datasheet.ciiva.com/2452/pyu-r-int-thick-7-2452613.pdf?src-supplier=Digikey; ComponentLink5URL: https://datasheet.ciiva.com/2452/pyu-r-int-thick-7-2452611.pdf?src-supplier=Digikey; ComponentLink5Description: https://datasheet.ciiva.com/2452/pyu-r-int-thick-7-2452611.pdf?src-supplier=Digikey; ComponentLink6URL: https://datasheet.ciiva.com/7850/1018594-7850223.pdf?src-supplier=Element14; ComponentLink6Description: https://datasheet.ciiva.com/7850/1018594-7850223.pdf?src-supplier=Element14; ComponentLink7URL: https://datasheet.ciiva.com/7850/1018594-7850222.pdf?src-supplier=Element14; ComponentLink7Description: https://datasheet.ciiva.com/7850/1018594-7850222.pdf?src-supplier=Element14; ComponentLink8URL: https://datasheet.ciiva.com/16800/pyu-rc0402-51-rohs-l-6-r-16800266.pdf?src-supplier=Future+Electronics; ComponentLink8Description: https://datasheet.ciiva.com/16800/pyu-rc0402-51-rohs-l-6-r-16800266.pdf?src-supplier=Future+Electronics; LCSC PART NUMBER: C105870
R11 R14 R17 R20 R21 = AC0402FR-075K1L: Fixed Resistor, Metal Glaze/thick Film, 0.0625W, 5100ohm, 50V, 1% +/-Tol, 100ppm/Cel, Surface Mount, 0402; Manufacturer: Yageo; Additional Feature: LASER TRIMMABLE; Power: 62.5mW; Rated Temperature: 70°C; Value: 5.1kR; Temperature Coefficient: 100ppm/°C; Package Height: 0.32mm; Package Length: 1mm; Package Width: 0.5mm; Reference Standard: AEC-Q200; Supplier: Future Electronics; Supplier Part Number: 8112408; Manufacturer Part Number: AC0402FR-075K1L; RoHS: Yes; Category: Chip SMD Resistors; Stock: 180000; Pricing: 10000=0.0012, 50000=0.0011, 300000=0.001, 1000000=0.001, 3000000=0.0009 (USD); Mounting Technology: Surface Mount; Pins: 2; Package Shape: Rectangular; Case/Package: 0402; Terminal Finish: Nickel; Min Operating Temperature: -55°C; Max Operating Temperature: 155°C; Tolerance: 1%; JESD-609 Code: e3; Resistor Type: FIXED RESISTOR; Construction: Chip; Package Style: SMTMeter; Packaging: Tape and Reel; Technology: METAL GLAZE/THICK FILM; Termination: Wraparound; Working Voltage: 50V; Reach SVHC Compliant: Yes; RoHS Compliant: Yes; ComponentLink1URL: https://datasheet.ciiva.com:443/pdfs/VipMasterIC/IC/YAGO/YAGO-S-A0003597364/YAGO-S-A0003597364-1.pdf?src-supplier=IHS+Markit; ComponentLink1Description: https://datasheet.ciiva.com:443/pdfs/VipMasterIC/IC/YAGO/YAGO-S-A0003597364/YAGO-S-A0003597364-1.pdf?src-supplier=IHS+Markit; ComponentLink2URL: https://datasheet.octopart.com/AC0402FR-075K1L-Yageo-datasheet-166720450.pdf?src-supplier=Future+Electronics; ComponentLink2Description: https://datasheet.octopart.com/AC0402FR-075K1L-Yageo-datasheet-166720450.pdf?src-supplier=Future+Electronics; ComponentLink3URL: http://www.yageo.com/documents/recent/PYu-AC_51_RoHS_L_2_revised.pdf?src-supplier=Future+Electronics; ComponentLink3Description: http://www.yageo.com/documents/recent/PYu-AC_51_RoHS_L_2_revised.pdf?src-supplier=Future+Electronics; LCSC PART NUMBER: C144745
R18 R26 = 0603WAF1001T5E: Manufacturer: Royal Electronic Factory; Supplier: Mouser; Supplier Part Number: 303-0603WAF1001T5E; Manufacturer Part Number: 0603WAF1001T5E; RoHS: No; Category: LDO; Stock: 310000; Pricing: 10000=0.001 (USD); ComponentLink1URL: https://datasheet.octopart.com/0603WAF1001T5E-Royal-Ohm-datasheet-165785611.pdf?src-supplier=TME; ComponentLink1Description: https://datasheet.octopart.com/0603WAF1001T5E-Royal-Ohm-datasheet-165785611.pdf?src-supplier=TME; LCSC PART NUMBER: C21190
R27 = RC0402FR-0751KL: Fixed Resistor, Metal Glaze/thick Film, 0.0625W, 51000ohm, 50V, 1% +/-Tol, 100ppm/Cel, Surface Mount, 0402; Manufacturer: Yageo; Additional Feature: LASER TRIMMABLE; Power: 62.5mW; Rated Temperature: 70°C; Value: 51kR; Temperature Coefficient: 100ppm/°C; Package Height: 0.35mm; Package Length: 1mm; Package Width: 0.5mm; Supplier: Digikey; Supplier Part Number: 311-51.0KLRTR-ND; Manufacturer Part Number: RC0402FR-0751KL; RoHS: Yes; Category: Chip SMD Resistors; Stock: 170000; Pricing: 10000=0.00261, 20000=0.00231, 30000=0.00216, 50000=0.00199, 100000=0.00179 (USD); Mounting Technology: Surface Mount; Pins: 2; Package Shape: Rectangular; Case/Package: 0402; Terminal Finish: Nickel; Min Operating Temperature: -55°C; Max Operating Temperature: 155°C; Tolerance: 1%; JESD-609 Code: e3; Resistor Type: FIXED RESISTOR; Packaging: Tape and Reel; Technology: METAL GLAZE/THICK FILM; Termination: Wraparound; Working Voltage: 50V; Construction: Chip; Package Style: SMTMeter; Reach SVHC Compliant: Yes; RoHS Compliant: Yes; ComponentLink1URL: https://datasheet.ciiva.com:443/pdfs/VipMasterIC/IC/YAGO/YAGO-S-A0008145938/YAGO-S-A0008145938-1.pdf?src-supplier=IHS+Markit; ComponentLink1Description: https://datasheet.ciiva.com:443/pdfs/VipMasterIC/IC/YAGO/YAGO-S-A0008145938/YAGO-S-A0008145938-1.pdf?src-supplier=IHS+Markit; ComponentLink2URL: https://datasheet.ciiva.com/2519/pyu-r-int-thick-7-2519211.pdf?src-supplier=Digikey; ComponentLink2Description: https://datasheet.ciiva.com/2519/pyu-r-int-thick-7-2519211.pdf?src-supplier=Digikey; ComponentLink3URL: https://datasheet.ciiva.com/2519/pyu-r-int-thick-7-2519212.pdf?src-supplier=Digikey; ComponentLink3Description: https://datasheet.ciiva.com/2519/pyu-r-int-thick-7-2519212.pdf?src-supplier=Digikey; ComponentLink4URL: https://datasheet.ciiva.com/2519/pyu-r-int-thick-7-2519210.pdf?src-supplier=Digikey; ComponentLink4Description: https://datasheet.ciiva.com/2519/pyu-r-int-thick-7-2519210.pdf?src-supplier=Digikey; ComponentLink5URL: https://datasheet.ciiva.com/7850/1018594-7850037.pdf?src-supplier=Element14; ComponentLink5Description: https://datasheet.ciiva.com/7850/1018594-7850037.pdf?src-supplier=Element14; LCSC PART NUMBER: C107229
R28 = RC0402FR-0722K1L: Fixed Resistor, Metal Glaze/thick Film, 0.0625W, 22100ohm, 50V, 1% +/-Tol, 100ppm/Cel, Surface Mount, 0402; Manufacturer: Yageo; Additional Feature: LASER TRIMMABLE; Power: 62.5mW; Rated Temperature: 70°C; Value: 22.1kR; Temperature Coefficient: 100ppm/°C; Package Height: 0.35mm; Package Length: 1mm; Package Width: 0.5mm; Supplier: Digikey; Supplier Part Number: 311-22.1KLRTR-ND; Manufacturer Part Number: RC0402FR-0722K1L; RoHS: Yes; Category: Chip SMD Resistors; Stock: 140000; Pricing: 10000=0.00261, 20000=0.00231, 30000=0.00216, 50000=0.00199, 100000=0.00179 (USD); Mounting Technology: Surface Mount; Pins: 2; Package Shape: Rectangular; Case/Package: 0402; Terminal Finish: Nickel; Min Operating Temperature: -55°C; Max Operating Temperature: 155°C; Tolerance: 1%; JESD-609 Code: e3; Package Style: SMTMeter; Packaging: Tape and Reel; Termination: Wraparound; Resistor Type: FIXED RESISTOR; Construction: Chip; Technology: METAL GLAZE/THICK FILM; Working Voltage: 50V; Reach SVHC Compliant: Yes; RoHS Compliant: Yes; ComponentLink1URL: https://datasheet.ciiva.com:443/pdfs/VipMasterIC/IC/YAGO/YAGO-S-A0008145938/YAGO-S-A0008145938-1.pdf?src-supplier=IHS+Markit; ComponentLink1Description: https://datasheet.ciiva.com:443/pdfs/VipMasterIC/IC/YAGO/YAGO-S-A0008145938/YAGO-S-A0008145938-1.pdf?src-supplier=IHS+Markit; ComponentLink2URL: https://datasheet.ciiva.com/7983/1018594-7983501.pdf?src-supplier=Element14; ComponentLink2Description: https://datasheet.ciiva.com/7983/1018594-7983501.pdf?src-supplier=Element14; ComponentLink3URL: https://datasheet.ciiva.com/2553/pyu-r-int-thick-7-2553201.pdf?src-supplier=Digikey; ComponentLink3Description: https://datasheet.ciiva.com/2553/pyu-r-int-thick-7-2553201.pdf?src-supplier=Digikey; ComponentLink4URL: https://datasheet.ciiva.com/2553/pyu-r-int-thick-7-2553202.pdf?src-supplier=Digikey; ComponentLink4Description: https://datasheet.ciiva.com/2553/pyu-r-int-thick-7-2553202.pdf?src-supplier=Digikey; LCSC PART NUMBER: C163478
SW1 SW2 = PTS645SM43SMTR92LFS: Keypad Switch, 1 Switches, SPST, Momentary-tactile, 0.05A, 12VDC, 1.57N, 4 PCB Hole Cnt, Solder Terminal, Surface Mount-straight; Manufacturer: ITT C&K; Actuator Type: Pushbutton; Contact Current(DC)-Max: 50mA; Contact DC Max Rating R Load: 0.05A@12VDC; Contact Resistance: 0.1mR; Contact Voltage(DC)-Max: 12V; Dielectric Withstand Volts: 250VACV; Electrical Life: 100000Cycles; Insulation Resistance: 100GR; PCB Hole Count: 4; Body Breadth: 5.9944inch; Body Height: 3.4544mm; Body Length or Diameter: 5.9944mm; Supplier: Mouser; Supplier Part Number: 611-PTS645SM43SMTR92; Manufacturer Part Number: PTS645SM43SMTR92LFS; RoHS: Yes; Category: Tactile Switches; Stock: 63870; Pricing: 1=0.23, 10=0.207, 50=0.207, 100=0.181, 1000=0.148, 10000=0.144 (USD); Mounting Technology: Surface Mount; Terminal Finish: Silver; Min Operating Temperature: -20°C; Max Operating Temperature: 60°C; JESD-609 Code: e4; Switch Action: MOMENTARY; Switch Function: SPST; Switch Type: Keypad; Termination: Solder; Terminal Length: 0.138inch; Reach SVHC Compliant: Yes; RoHS Compliant: Yes; ComponentLink1URL: https://datasheet.ciiva.com:443/pdfs/VipMasterIC/IC/CKCI/CKCI-S-A0001796527/CKCI-S-A0001796842-1.pdf?src-supplier=IHS+Markit; ComponentLink1Description: https://datasheet.ciiva.com:443/pdfs/VipMasterIC/IC/CKCI/CKCI-S-A0001796527/CKCI-S-A0001796842-1.pdf?src-supplier=IHS+Markit; ComponentLink2URL: https://datasheet.ciiva.com/29903/getdatasheetpartid-786341-29903846.pdf?src-supplier=Verical; ComponentLink2Description: https://datasheet.ciiva.com/29903/getdatasheetpartid-786341-29903846.pdf?src-supplier=Verical; ComponentLink3URL: https://datasheet.ciiva.com/29931/getdatasheetpartid-764615-29931183.pdf?src-supplier=Verical; ComponentLink3Description: https://datasheet.ciiva.com/29931/getdatasheetpartid-764615-29931183.pdf?src-supplier=Verical; ComponentLink4URL: https://datasheet.ciiva.com/14920/pts645-14920734.pdf?src-supplier=Digikey; ComponentLink4Description: https://datasheet.ciiva.com/14920/pts645-14920734.pdf?src-supplier=Digikey; ComponentLink5URL: https://datasheet.ciiva.com/14920/pts645-14920735.pdf?src-supplier=Digikey; ComponentLink5Description: https://datasheet.ciiva.com/14920/pts645-14920735.pdf?src-supplier=Digikey; ComponentLink6URL: https://datasheet.ciiva.com/14920/pts645-14920733.pdf?src-supplier=Digikey; ComponentLink6Description: https://datasheet.ciiva.com/14920/pts645-14920733.pdf?src-supplier=Digikey; LCSC PART NUMBER: C221880
U1 = ESP32-S3-MINI-1U-N8_1: Manufacturer: Espressif Systems; Supplier: Mouser; Supplier Part Number: 356-ESP32S3MINI1UN8; Manufacturer Part Number: ESP32-S3-MINI-1U-N8; RoHS: No; Category: LDO; Stock: 4263; Pricing: 1=3.1, 10=3.1, 50=3.1, 100=3.1, 1000=3.1, 10000=3.1 (USD); LCSC PART NUMBER: C2980299
U2 = LMR50410Y3FQDBVRQ1: Switching Regulator, Current-mode, 1A, 2100kHz Switching Freq-Max, PDSO6; Manufacturer: Texas Instruments; Supplier: LCSC; Supplier Part Number: C5219374; Manufacturer Part Number: LMR50410Y3FQDBVRQ1; RoHS: Yes; Category: Voltage Regulators - Switching; Stock: 165; Pricing: 1=0.927, 10=0.8198, 30=0.7189, 100=0.6432, 500=0.6117, 1000=0.5975 (USD); LCSC PART NUMBER: C5219374
U3 = FT231XQ-R: Microprocessor Circuit, CMOS; Manufacturer: FTDI; Power Supplies: 3.3/5V; Max Supply Current: 8.4mA; Max Supply Voltage: 5.5V; Min Supply Voltage: 2.97V; Nominal Supply Voltage: 5V; Qualification Status: Not Qualified; Supplier: Rs; Supplier Part Number: 7570045P; Manufacturer Part Number: FT231XQ-R; RoHS: Yes; Category: Interface ICs; Stock: 17616; Pricing: 10=1.655, 40=1.535, 100=1.485, 200=1.455 (GBP); Case/Package: HVQCCN; Pins: 20; Package Shape: Square; Min Operating Temperature: -40°C; Max Operating Temperature: 85°C; JESD-30 Code: S-XQCC-N20; Package Style: CHIP CARRIER, HEAT SINK/SLUG, VERY THIN PROFILEMeter; Surface Mount: Yes; Technology: CMOS; Terminal Form: No Lead; Terminal Position: QUAD; Length: 4mm; Width: 4mm; Height - Seated (Max): 0.8mm; Terminal Pitch: 0.5mm; Temperature Grade: INDUSTRIAL; Reach SVHC Compliant: Yes; RoHS Compliant: Yes; ComponentLink1URL: https://datasheet.ciiva.com:443/pdfs/VipMasterIC/IC/FTDI/FTDIS00099/FTDIS00099-1.pdf?src-supplier=IHS+Markit; ComponentLink1Description: https://datasheet.ciiva.com:443/pdfs/VipMasterIC/IC/FTDI/FTDIS00099/FTDIS00099-1.pdf?src-supplier=IHS+Markit; ComponentLink2URL: https://datasheet.ciiva.com/1787/ds-ft231x-1787312.pdf?src-supplier=Digikey; ComponentLink2Description: https://datasheet.ciiva.com/1787/ds-ft231x-1787312.pdf?src-supplier=Digikey; ComponentLink3URL: https://datasheet.ciiva.com/4787/ds-ft231x-13571-4787570.pdf?src-supplier=Mouser; ComponentLink3Description: https://datasheet.ciiva.com/4787/ds-ft231x-13571-4787570.pdf?src-supplier=Mouser; ComponentLink4URL: https://datasheet.ciiva.com/30475/0900766b811020d3-30475405.pdf?src-supplier=Rs; ComponentLink4Description: https://datasheet.ciiva.com/30475/0900766b811020d3-30475405.pdf?src-supplier=Rs; ComponentLink5URL: https://datasheet.ciiva.com/1787/ft-x-series-1787313.pdf?src-supplier=Digikey; ComponentLink5Description: https://datasheet.ciiva.com/1787/ft-x-series-1787313.pdf?src-supplier=Digikey; ComponentLink6URL: https://datasheet.ciiva.com/1787/ft-x-series-1787314.pdf?src-supplier=Digikey; ComponentLink6Description: https://datasheet.ciiva.com/1787/ft-x-series-1787314.pdf?src-supplier=Digikey; LCSC PART NUMBER: C132159

## Assembly variants
PROTOTYPE: not fitted C7 R3 R12 R13 R22 R24